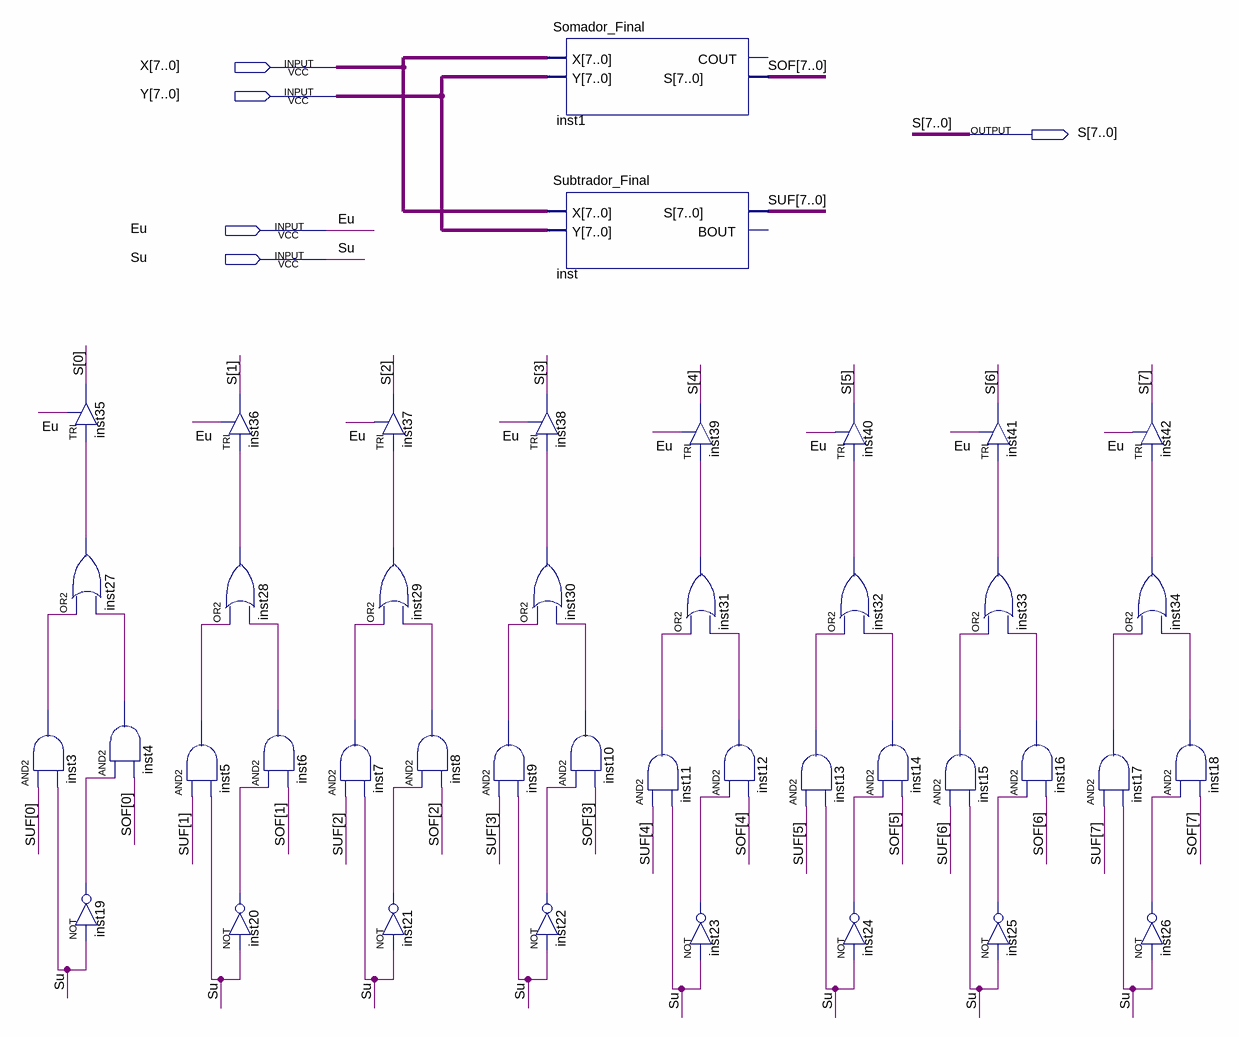
[diagram p0: schematic sheet]
// Quartus schematic Somador_Subtrador.bdf as structural Verilog: 42 symbols, 5 pins
module Somador_Subtrador (
  input  [7:0] X,
  input  [7:0] Y,
  input  Eu,
  input  Su,
  output [7:0] S
);

  wire inst3_out, inst4_out, inst5_out, inst6_out, inst7_out, inst8_out, inst9_out, inst10_out, inst11_out,
       inst12_out, inst13_out, inst14_out, inst15_out, inst16_out, inst17_out, inst18_out, inst19_out,
       inst20_out, inst21_out, inst22_out, inst23_out, inst24_out, inst25_out, inst26_out, inst27_out,
       inst28_out, inst29_out, inst30_out, inst31_out, inst32_out, inst33_out, inst34_out;
  wire [7:0] SOF, SUF;

  and inst3 (inst3_out, SUF[0], Su);
  TRI inst35 (.IN(inst27_out), .OE(Eu), .OUT(S[0]));
  or inst27 (inst27_out, inst3_out, inst4_out);
  and inst4 (inst4_out, inst19_out, SOF[0]);
  not inst19 (inst19_out, Su);
  and inst5 (inst5_out, SUF[1], Su);
  TRI inst36 (.IN(inst28_out), .OE(Eu), .OUT(S[1]));
  or inst28 (inst28_out, inst5_out, inst6_out);
  and inst6 (inst6_out, inst20_out, SOF[1]);
  not inst20 (inst20_out, Su);
  and inst7 (inst7_out, SUF[2], Su);
  TRI inst37 (.IN(inst29_out), .OE(Eu), .OUT(S[2]));
  or inst29 (inst29_out, inst7_out, inst8_out);
  and inst8 (inst8_out, inst21_out, SOF[2]);
  not inst21 (inst21_out, Su);
  and inst9 (inst9_out, SUF[3], Su);
  Somador_Final inst1 (.X(X), .Y(Y), .S(SOF));  // open: COUT
  Subtrador_Final inst (.X(X), .Y(Y), .S(SUF));  // open: BOUT
  TRI inst38 (.IN(inst30_out), .OE(Eu), .OUT(S[3]));
  or inst30 (inst30_out, inst9_out, inst10_out);
  and inst10 (inst10_out, inst22_out, SOF[3]);
  not inst22 (inst22_out, Su);
  and inst11 (inst11_out, SUF[4], Su);
  TRI inst39 (.IN(inst31_out), .OE(Eu), .OUT(S[4]));
  or inst31 (inst31_out, inst11_out, inst12_out);
  and inst12 (inst12_out, inst23_out, SOF[4]);
  not inst23 (inst23_out, Su);
  and inst13 (inst13_out, SUF[5], Su);
  TRI inst40 (.IN(inst32_out), .OE(Eu), .OUT(S[5]));
  or inst32 (inst32_out, inst13_out, inst14_out);
  and inst14 (inst14_out, inst24_out, SOF[5]);
  not inst24 (inst24_out, Su);
  and inst15 (inst15_out, SUF[6], Su);
  TRI inst41 (.IN(inst33_out), .OE(Eu), .OUT(S[6]));
  or inst33 (inst33_out, inst15_out, inst16_out);
  and inst16 (inst16_out, inst25_out, SOF[6]);
  not inst25 (inst25_out, Su);
  and inst17 (inst17_out, SUF[7], Su);
  TRI inst42 (.IN(inst34_out), .OE(Eu), .OUT(S[7]));
  or inst34 (inst34_out, inst17_out, inst18_out);
  and inst18 (inst18_out, inst26_out, SOF[7]);
  not inst26 (inst26_out, Su);
endmodule
